# EAGLE design circuit (EAGLE 9.6.2)

## Sheet 1 of 2
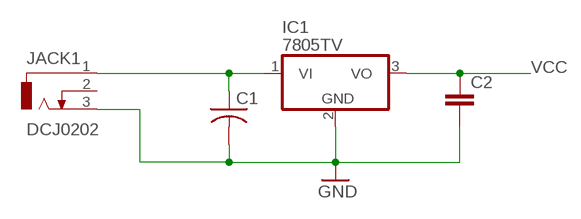
[diagram p0: schematic, sheet 1]

### Parts
C1  C-US025-030X050  [C025-030X050]
C2  C-EU025-030X050  [C025-030X050]
IC1  7805TV  [TO220V]
JACK1  DCJ0202  [DCJ0202]

### Nets
GND [power]: C1.2 C2.2 IC1.2(GND) JACK1.3 ; also sheet 2
VCC [power]: C2.1 IC1.3(VO) ; also sheet 2
VIN [power]: C1.1 IC1.1(VI) JACK1.1
Unconnected: JACK1.2

## Sheet 2 of 2
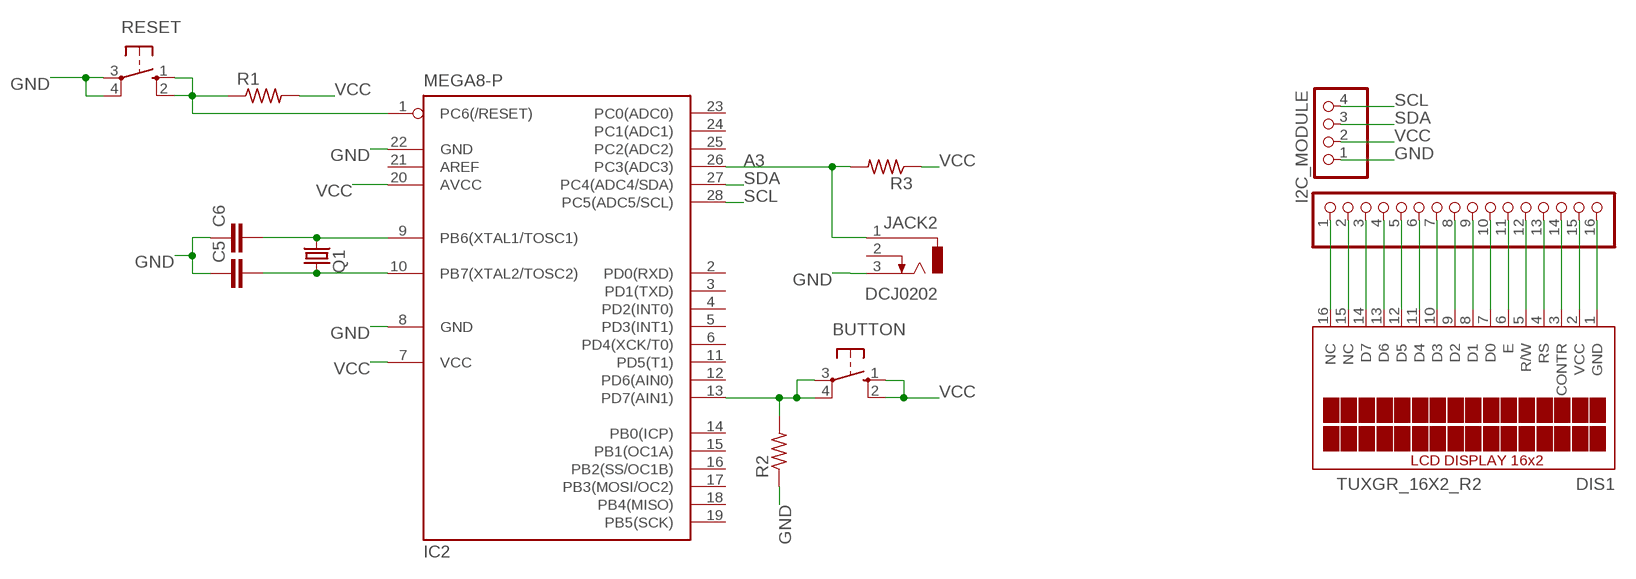
[diagram p1: schematic, sheet 2]

### Parts
BUTTON  10-XX  [B3F-10XX]
C5  C-EU025-025X050  [C025-025X050]
C6  C-EU025-025X050  [C025-025X050]
DIS1  TUXGR_16X2_R2  [TUXGR_16X2_R2]
I2C_MODULE  PINHD-1X4  [1X04]
IC2  MEGA8-P  [DIL28-3]
JACK2  DCJ0202  [DCJ0202]
JP1  PINHD-1X16  [1X16]
Q1  CRYSTALHC49U-V  [HC49U-V]
R1  R-US_0207/10  [0207/10]
R2  R-US_0207/10  [0207/10]
R3  R-US_0207/10  [0207/10]
RESET  10-XX  [B3F-10XX]

### Nets
A3: IC2.26(PC3(ADC3)) JACK2.1 R3.2
D7: BUTTON.3(P) BUTTON.4(P1) IC2.13(PD7(AIN1)) R2.2
GND [power]: C5.1 C6.1 I2C_MODULE.1 IC2.8(GND) IC2.22(GND) JACK2.3 R2.1 RESET.3(P) RESET.4(P1) ; also sheet 1
N$2: DIS1.1(GND) JP1.16
N$3: DIS1.2(VCC) JP1.15
N$4: DIS1.3(CONTR) JP1.14
N$5 [power]: C6.2 IC2.9(PB6(XTAL1/TOSC1)) Q1.2
N$6: DIS1.4(RS) JP1.13
N$7 [power]: C5.2 IC2.10(PB7(XTAL2/TOSC2)) Q1.1
N$8: DIS1.5(R/W) JP1.12
N$9: DIS1.6(E) JP1.11
N$10: DIS1.7(D0) JP1.10
N$11: DIS1.8(D1) JP1.9
N$12: DIS1.9(D2) JP1.8
N$13: DIS1.10(D3) JP1.7
N$14: DIS1.11(D4) JP1.6
N$15: DIS1.12(D5) JP1.5
N$16: DIS1.13(D6) JP1.4
N$17: DIS1.14(D7) JP1.3
N$18: DIS1.15(NC) JP1.2
N$19: DIS1.16(NC) JP1.1
N$20: IC2.1(PC6(/RESET)) R1.1 RESET.1(S) RESET.2(S1)
SCL: I2C_MODULE.4 IC2.28(PC5(ADC5/SCL))
SDA: I2C_MODULE.3 IC2.27(PC4(ADC4/SDA))
VCC [power]: BUTTON.1(S) BUTTON.2(S1) I2C_MODULE.2 IC2.7(VCC) IC2.20(AVCC) R1.2 R3.1 ; also sheet 1
Unconnected: IC2.2(PD0(RXD)) IC2.3(PD1(TXD)) IC2.4(PD2(INT0)) IC2.5(PD3(INT1)) IC2.6(PD4(XCK/T0)) IC2.11(PD5(T1)) IC2.12(PD6(AIN0)) IC2.14(PB0(ICP)) IC2.15(PB1(OC1A)) IC2.16(PB2(SS/OC1B)) IC2.17(PB3(MOSI/OC2)) IC2.18(PB4(MISO)) IC2.19(PB5(SCK)) IC2.21(AREF) IC2.23(PC0(ADC0)) IC2.24(PC1(ADC1)) IC2.25(PC2(ADC2)) JACK2.2

## Library data of the parts
BUTTON RESET = switch-omron:10-XX: OMRON SWITCH; MPN: B3F-1000; OC_FARNELL: 176432; OC_NEWARK: 36M3542
C1 = rcl:C-US: CAPACITOR, American symbol; SPICEPREFIX: C
C2 C5 C6 = rcl:C-EU: CAPACITOR, European symbol; SPICEPREFIX: C
DIS1 = display-lcd:TUXGR_16X2_R2: Tuxgraphics LCD display 16x2 characters reflective, without background light Source: tuxgr_12x2_r2.pdf; OC_FARNELL: unknown; OC_NEWARK: unknown
I2C_MODULE = pinhead:PINHD-1X4: PIN HEADER
IC1 = linear:78*: Positive VOLTAGE REGULATOR Source: http://cache.national.com/ds/LM/LM78L05.pdf http://www.fairchildsemi.com/ds/LM/LM7805.pdf
IC2 = atmel:MEGA8-P: MICROCONTROLLER 8 Kbytes FLASH, 1 kbytes SRAM, 512 bytes EEPROM, USART, 4-channel 10 bit ADC, 2-channel 8 bit ADC Pin compatible with Atmega48, ATMega88, ATMega168 Source: avr.lbr; OC_FARNELL: unknown; OC_NEWARK: unknown
JACK1 JACK2 = con-jack:DCJ0202: DC POWER JACK Source: DCJ0202.pdf; OC_FARNELL: unknown; OC_NEWARK: unknown
JP1 = pinhead:PINHD-1X16: PIN HEADER
Q1 = crystal:CRYSTAL: CRYSTAL; OC_FARNELL: 1666969; OC_NEWARK: unknown
R1-R3 = rcl:R-US_: RESISTOR, American symbol; SPICEPREFIX: R

## Net classes
0 signal: width 1 mm
1 power: width 1 mm

## Board
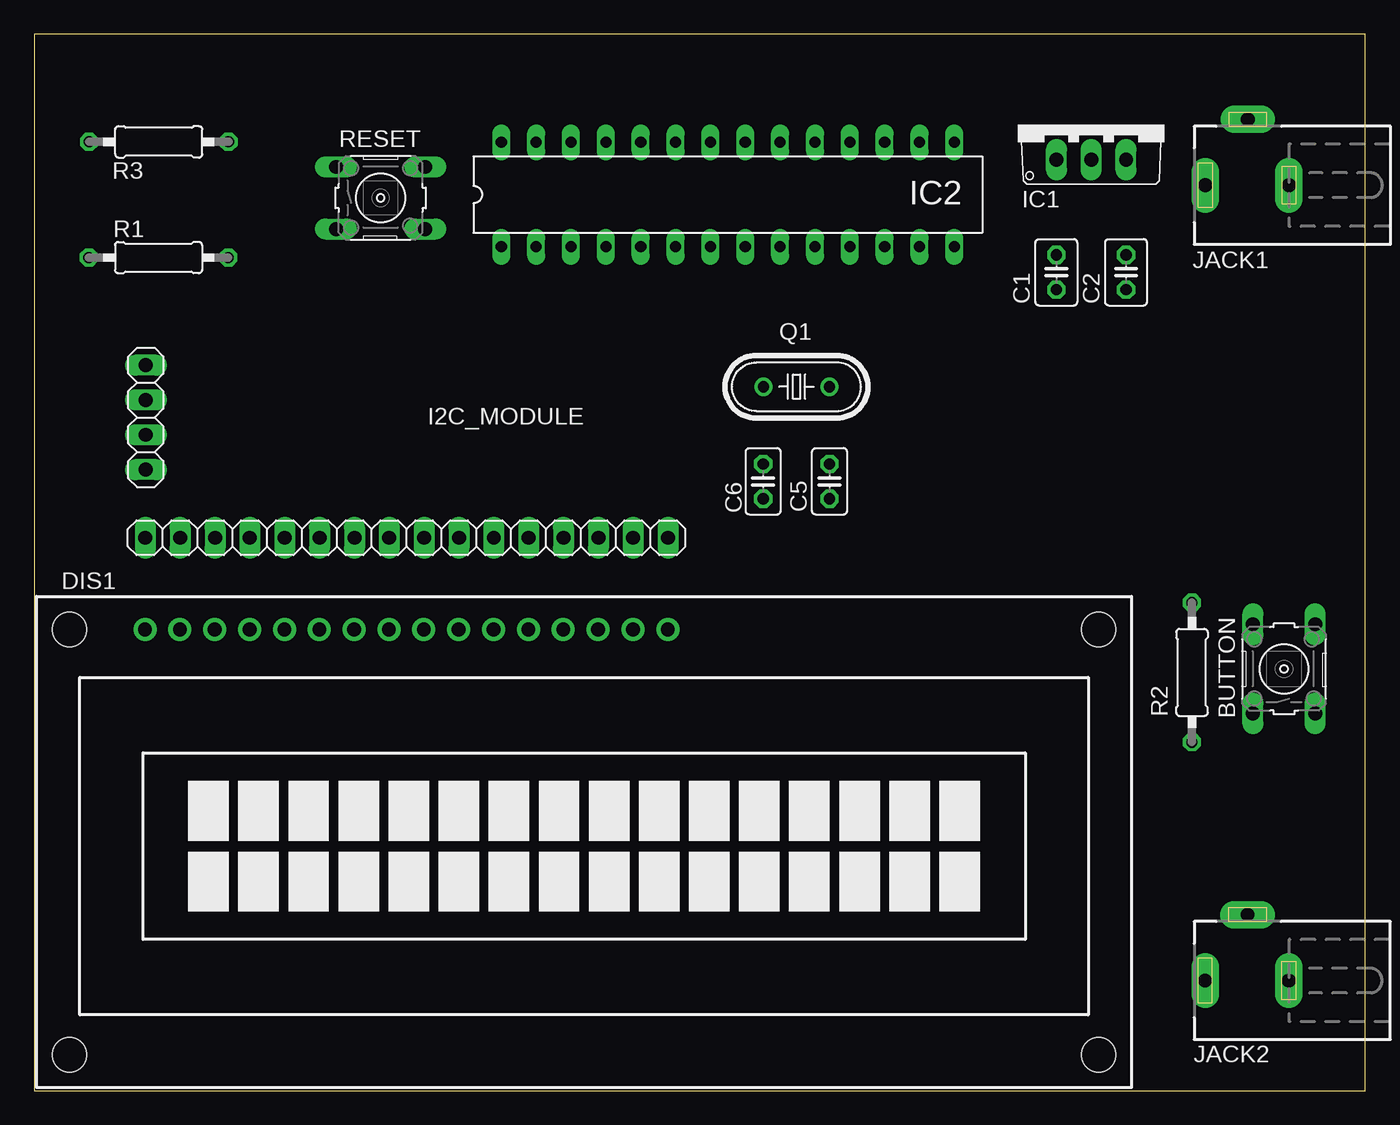
[diagram p2: board, top side]
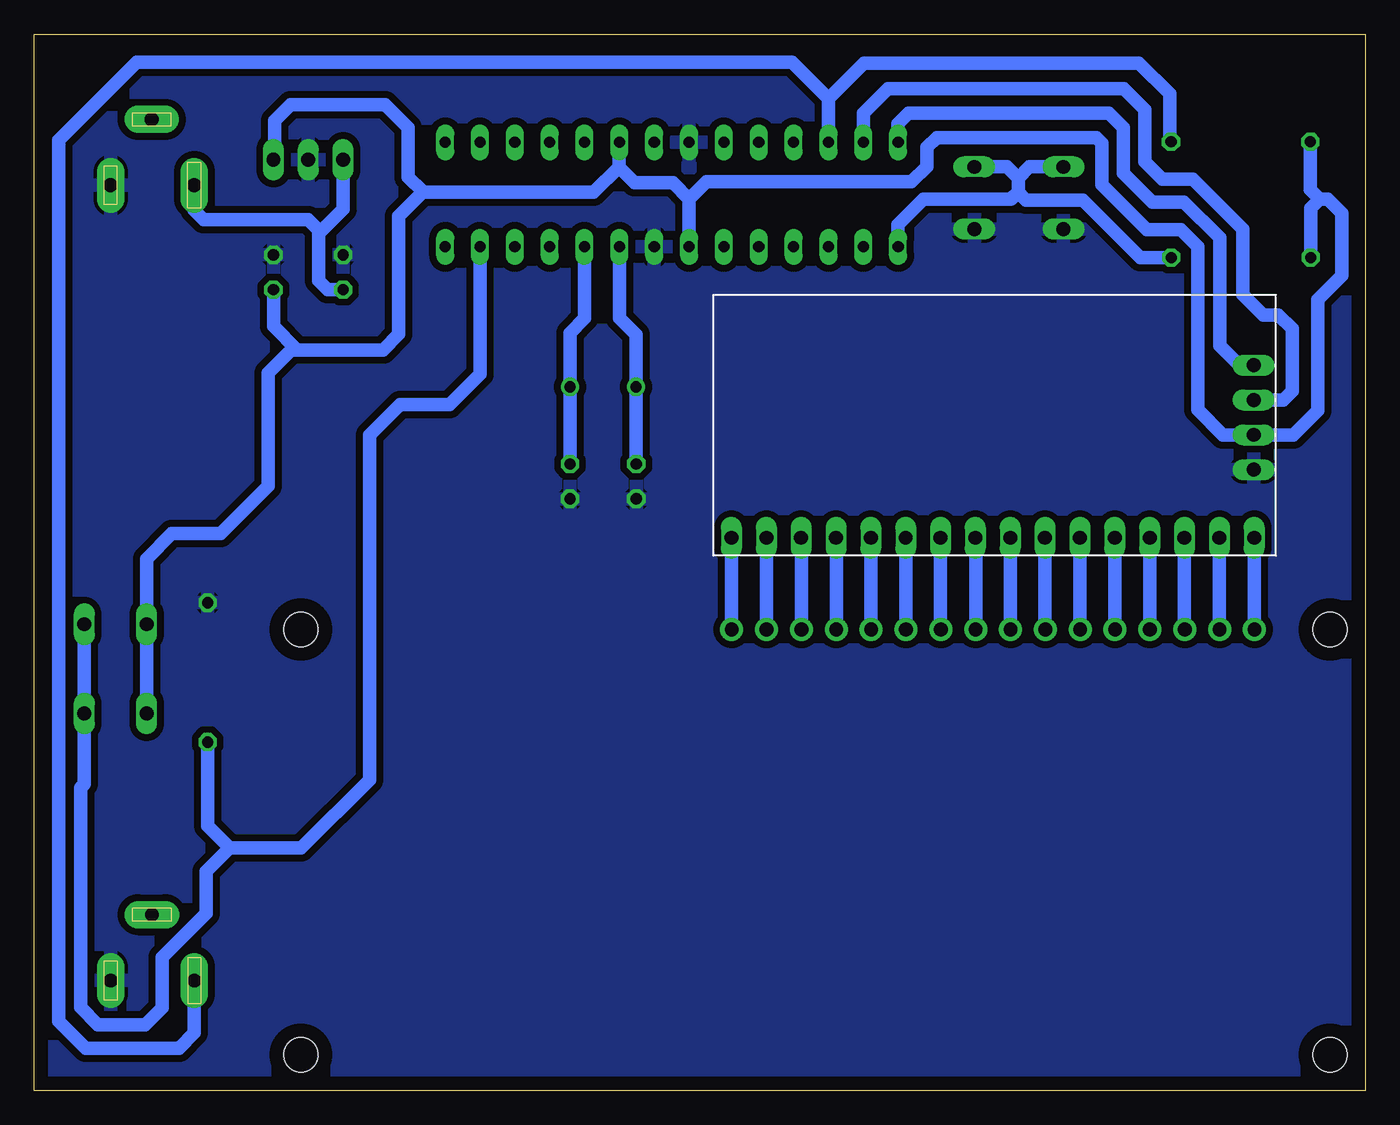
[diagram p3: board, bottom side, seen from below]

Size 97 x 77 mm. Coordinates in mm from the lower left corner, seen from the top.
Outline: 0,0 97,0 97,77 0,77 0,0
Copper layers (1*16): Top 0.035mm / dielectric 1.5mm / Bottom 0.035mm
Design rules "default": minimum track width 6mil, minimum drill 0.35mm, track to track 6mil, track to pad 6mil, pad to pad 6mil, via to via 6mil, smd to smd 6mil, copper to edge 40mil, drill to drill 6mil, minimum pad ring 10mil, minimum via ring 8mil, stop-mask expansion 4mil, vias tented up to drill 0mil, thermal gap 10mil

### Footprints (pad centres in the part's own frame; a part is rotated, then mirrored left to right if it is on the bottom)
B3F-10XX = drill 1.016 long: 1 -3.251,2.261; 2 3.251,2.261; 3 -3.251,-2.261; 4 3.251,-2.261
C025-030X050 = drill 0.813 octagon: 1 -1.27,0; 2 1.27,0
C025-025X050 = drill 0.813 octagon: 1 -1.27,0; 2 1.27,0
TUXGR_16X2_R2 = drill 1 pad 1.676: 1 -32,15.5; 2 -29.46,15.5; 3 -26.92,15.5; 4 -24.38,15.5; 5 -21.84,15.5; 6 -19.3,15.5; 7 -16.76,15.5; 8 -14.22,15.5; 9 -11.68,15.5; 10 -9.14,15.5; 11 -6.6,15.5; 12 -4.06,15.5; 13 -1.52,15.5; 14 1.02,15.5; 15 3.56,15.5; 16 6.1,15.5 | hole 2.5: -37.5,-15.5; 37.5,-15.5; -37.5,15.5; 37.5,15.5
1X04 = drill 1.016 long: 1 -3.81,0; 2 -1.27,0; 3 1.27,0; 4 3.81,0
TO220V = drill 1.016 long: 1 -2.54,-2.54; 2 0,-2.54; 3 2.54,-2.54
DIL28-3 = drill 0.813 long: 1 -16.51,-3.81; 2 -13.97,-3.81; 3 -11.43,-3.81; 4 -8.89,-3.81; 5 -6.35,-3.81; 6 -3.81,-3.81; 7 -1.27,-3.81; 8 1.27,-3.81; 9 3.81,-3.81; 10 6.35,-3.81; 11 8.89,-3.81; 12 11.43,-3.81; 13 13.97,-3.81; 14 16.51,-3.81; 15 16.51,3.81; 16 13.97,3.81; 17 11.43,3.81; 18 8.89,3.81; 19 6.35,3.81; 20 3.81,3.81; 21 1.27,3.81; 22 -1.27,3.81; 23 -3.81,3.81; 24 -6.35,3.81; 25 -8.89,3.81; 26 -11.43,3.81; 27 -13.97,3.81; 28 -16.51,3.81
DCJ0202 = drill 1 pad 2 long: 1 0,3.1; 2 4.8,0; 3 0,-3
1X16 = drill 1.016 long: 1 -19.05,0; 2 -16.51,0; 3 -13.97,0; 4 -11.43,0; 5 -8.89,0; 6 -6.35,0; 7 -3.81,0; 8 -1.27,0; 9 1.27,0; 10 3.81,0; 11 6.35,0; 12 8.89,0; 13 11.43,0; 14 13.97,0; 15 16.51,0; 16 19.05,0
HC49U-V = drill 0.813: 1 -2.413,0; 2 2.413,0
0207/10 = drill 0.813 octagon: 1 -5.08,0; 2 5.08,0

### Placement (x,y rotation side)
BUTTON  91.08,30.75 90 top
C1  74.49,59.65 90 top
C2  79.57,59.65 90 top
C5  57.96,44.41 90 top
C6  53.12,44.41 90 top
DIS1  40.07,18.12 0 top
I2C_MODULE  8.13,49.08 90 top
IC1  77.03,70.4 0 top
IC2  50.55,65.32 0 top
JACK1  88.44,66 90 top
JACK2  88.43,8.03 90 top
JP1  27.14,40.3 180 top
Q1  55.55,51.31 180 top
R1  9.05,60.73 180 top
R2  84.37,30.49 270 top
R3  9.07,69.16 0 top
RESET  25.25,65.07 0 top

### Tracks (layer width: path | path; a pad name or v marks a point on that pad's centre or on a via)
A3
  Bottom 1: R3.2 14.25,69.25 14.25,72.67 16.48,74.9 36.53,74.9 39.12,72.32 | IC2.26 39.12,72.32 | 39.12,72.32 41.77,74.98 89.53,74.98 95.22,69.29 95.22,5.07 93.25,3.09 86.46,3.09 85.33,4.22 JACK2.1
D7
  Bottom 1: IC2.13 64.52,52.23 66.73,50.02 70.33,50.02 72.58,47.77 72.58,22.65 77.55,17.68 82.75,17.68 | R2.2 84.37,19.3 82.75,17.68 | 82.75,17.68 84.47,15.97 84.47,12.92 87.68,9.71 87.68,6.04 88.92,4.8 92.38,4.8 93.63,6.06 93.63,22.06 93.35,22.35 BUTTON.3 BUTTON.4
GND
  pour Bottom (isolate 0.5): 0,77 0,0 97,0 97,77
N$2
  Bottom 1: JP1.16 8.09,33.64 DIS1.1
N$3
  Bottom 1: JP1.15 10.63,33.64 DIS1.2
N$4
  Bottom 1: JP1.14 13.17,33.64 DIS1.3
N$5
  Bottom 1: C6.2 53.14,45.7 Q1.2 53.14,55.09 54.36,56.31 IC2.9
N$6
  Bottom 1: JP1.13 15.71,33.64 DIS1.4
N$7
  Bottom 1: C5.2 Q1.1 57.96,55.23 56.9,56.3 IC2.10
N$8
  Bottom 1: JP1.12 18.25,33.64 DIS1.5
N$9
  Bottom 1: JP1.11 20.79,33.64 DIS1.6
N$10
  Bottom 1: JP1.10 23.33,33.64 DIS1.7
N$11
  Bottom 1: DIS1.8 25.85,40.28 JP1.9
N$12
  Bottom 1: DIS1.9 28.39,40.28 JP1.8
N$13
  Bottom 1: DIS1.10 30.95,33.64 JP1.7
N$14
  Bottom 1: DIS1.11 33.47,40.28 JP1.6
N$15
  Bottom 1: DIS1.12 36.01,40.28 JP1.5
N$16
  Bottom 1: DIS1.13 38.55,40.28 JP1.4
N$17
  Bottom 1: DIS1.14 41.09,40.28 JP1.3
N$18
  Bottom 1: DIS1.15 43.63,40.28 JP1.2
N$19
  Bottom 1: DIS1.16 46.17,40.28 JP1.1
N$20
  Bottom 1: 25.29,66.5 26.12,67.33 RESET.2 | 25.29,66.5 24.46,67.33 RESET.1 | 25.29,66.5 25.29,65.5 | 25.29,65.5 25.81,64.97 32.2,64.97 34.04,63.13 IC2.1 | 25.29,65.5 24.71,64.92 20.58,64.92 16.38,60.73 R1.1
SCL
  Bottom 1: IC2.28 34.04,70.48 33.27,71.24 18.7,71.24 17.63,70.18 17.63,66.89 15.52,64.78 13.2,64.78 10.6,62.17 10.6,54.31 9.18,52.89 I2C_MODULE.4
SDA
  Bottom 1: IC2.27 36.58,71.24 34.77,73.05 17.61,73.05 16.05,71.49 16.05,67.72 14.77,66.44 12.57,66.44 8.92,62.79 8.92,58.04 7.42,56.54 6.33,56.54 5.33,55.54 5.33,51.01 5.99,50.35 I2C_MODULE.3
VCC
  Bottom 1: R3.1 3.99,65.67 3.31,64.98 | 3.31,64.98 2.73,64.98 1.72,63.97 1.72,59.42 3.47,57.66 3.47,49.56 5.23,47.81 I2C_MODULE.2 10.37,47.81 12.21,49.64 12.21,61.54 13.43,62.76 15.91,62.76 19.18,66.03 19.18,69.07 19.59,69.48 31.23,69.48 31.95,68.76 31.95,67.36 33.06,66.25 48.02,66.25 49.28,64.99 | 3.31,64.98 3.97,64.31 R1.2 | 77.83,53.98 71.58,53.98 70.43,55.13 70.43,63.75 68.74,65.44 | 77.83,53.98 78.29,53.98 79.95,52.32 79.95,44.07 83.42,40.61 86.98,40.61 88.82,38.77 BUTTON.2 BUTTON.1 | 77.83,53.98 79.57,55.72 C2.1 | 54.39,67.32 53.24,66.17 50.46,66.17 49.28,64.99 | IC2.20 54.39,69.1 54.39,67.32 | 54.39,67.32 56.23,65.48 68.7,65.48 68.74,65.44 | IC1.3 79.5,67.93 79.5,70.69 78.31,71.87 71.42,71.87 69.74,70.19 69.74,66.58 68.74,65.59 68.74,65.44 | IC2.7 49.28,64.99
VIN
  Bottom 1: JACK1.1 85.35,64.18 84.66,63.49 77.03,63.49 76.27,62.73 | C1.1 75.61,58.38 76.27,59.03 76.27,62.73 | IC1.1 74.49,64.26 76.02,62.73 76.27,62.73